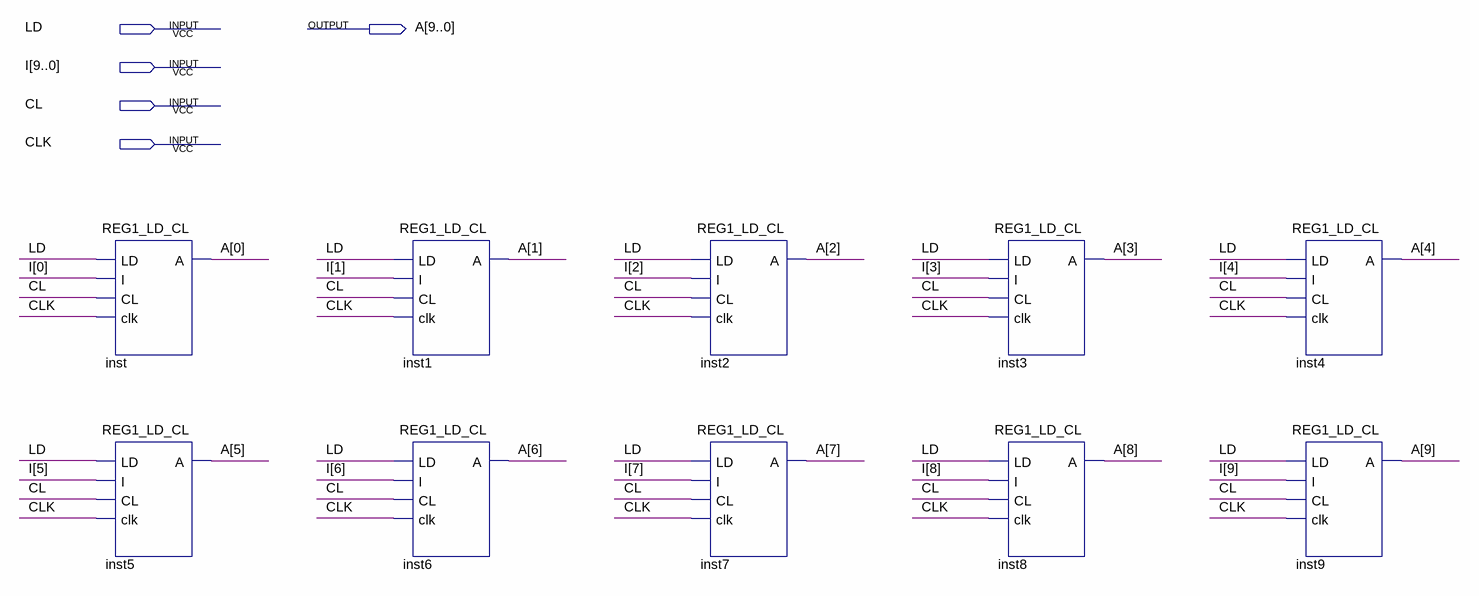
[diagram p0: schematic sheet]
// Quartus schematic REG10_LD_CL.bdf as structural Verilog: 10 symbols, 5 pins
module REG10_LD_CL (
  input  LD,
  input  [9:0] I,
  input  CL,
  input  CLK,
  output [9:0] A
);

  REG1_LD_CL inst (.LD(LD), .I(I[0]), .CL(CL), .clk(CLK), .A(A[0]));
  REG1_LD_CL inst5 (.LD(LD), .I(I[5]), .CL(CL), .clk(CLK), .A(A[5]));
  REG1_LD_CL inst1 (.LD(LD), .I(I[1]), .CL(CL), .clk(CLK), .A(A[1]));
  REG1_LD_CL inst6 (.LD(LD), .I(I[6]), .CL(CL), .clk(CLK), .A(A[6]));
  REG1_LD_CL inst2 (.LD(LD), .I(I[2]), .CL(CL), .clk(CLK), .A(A[2]));
  REG1_LD_CL inst7 (.LD(LD), .I(I[7]), .CL(CL), .clk(CLK), .A(A[7]));
  REG1_LD_CL inst3 (.LD(LD), .I(I[3]), .CL(CL), .clk(CLK), .A(A[3]));
  REG1_LD_CL inst8 (.LD(LD), .I(I[8]), .CL(CL), .clk(CLK), .A(A[8]));
  REG1_LD_CL inst4 (.LD(LD), .I(I[4]), .CL(CL), .clk(CLK), .A(A[4]));
  REG1_LD_CL inst9 (.LD(LD), .I(I[9]), .CL(CL), .clk(CLK), .A(A[9]));
endmodule
